# Altium schematic sheet Ethernet.SchDoc: Bluetooth Gateway
size A3; CheckedBy: QUOCTHANG; DrawnBy: DONGKHOA; Revision: V1.0.0; SheetNumber: 7; SheetTotal: 10
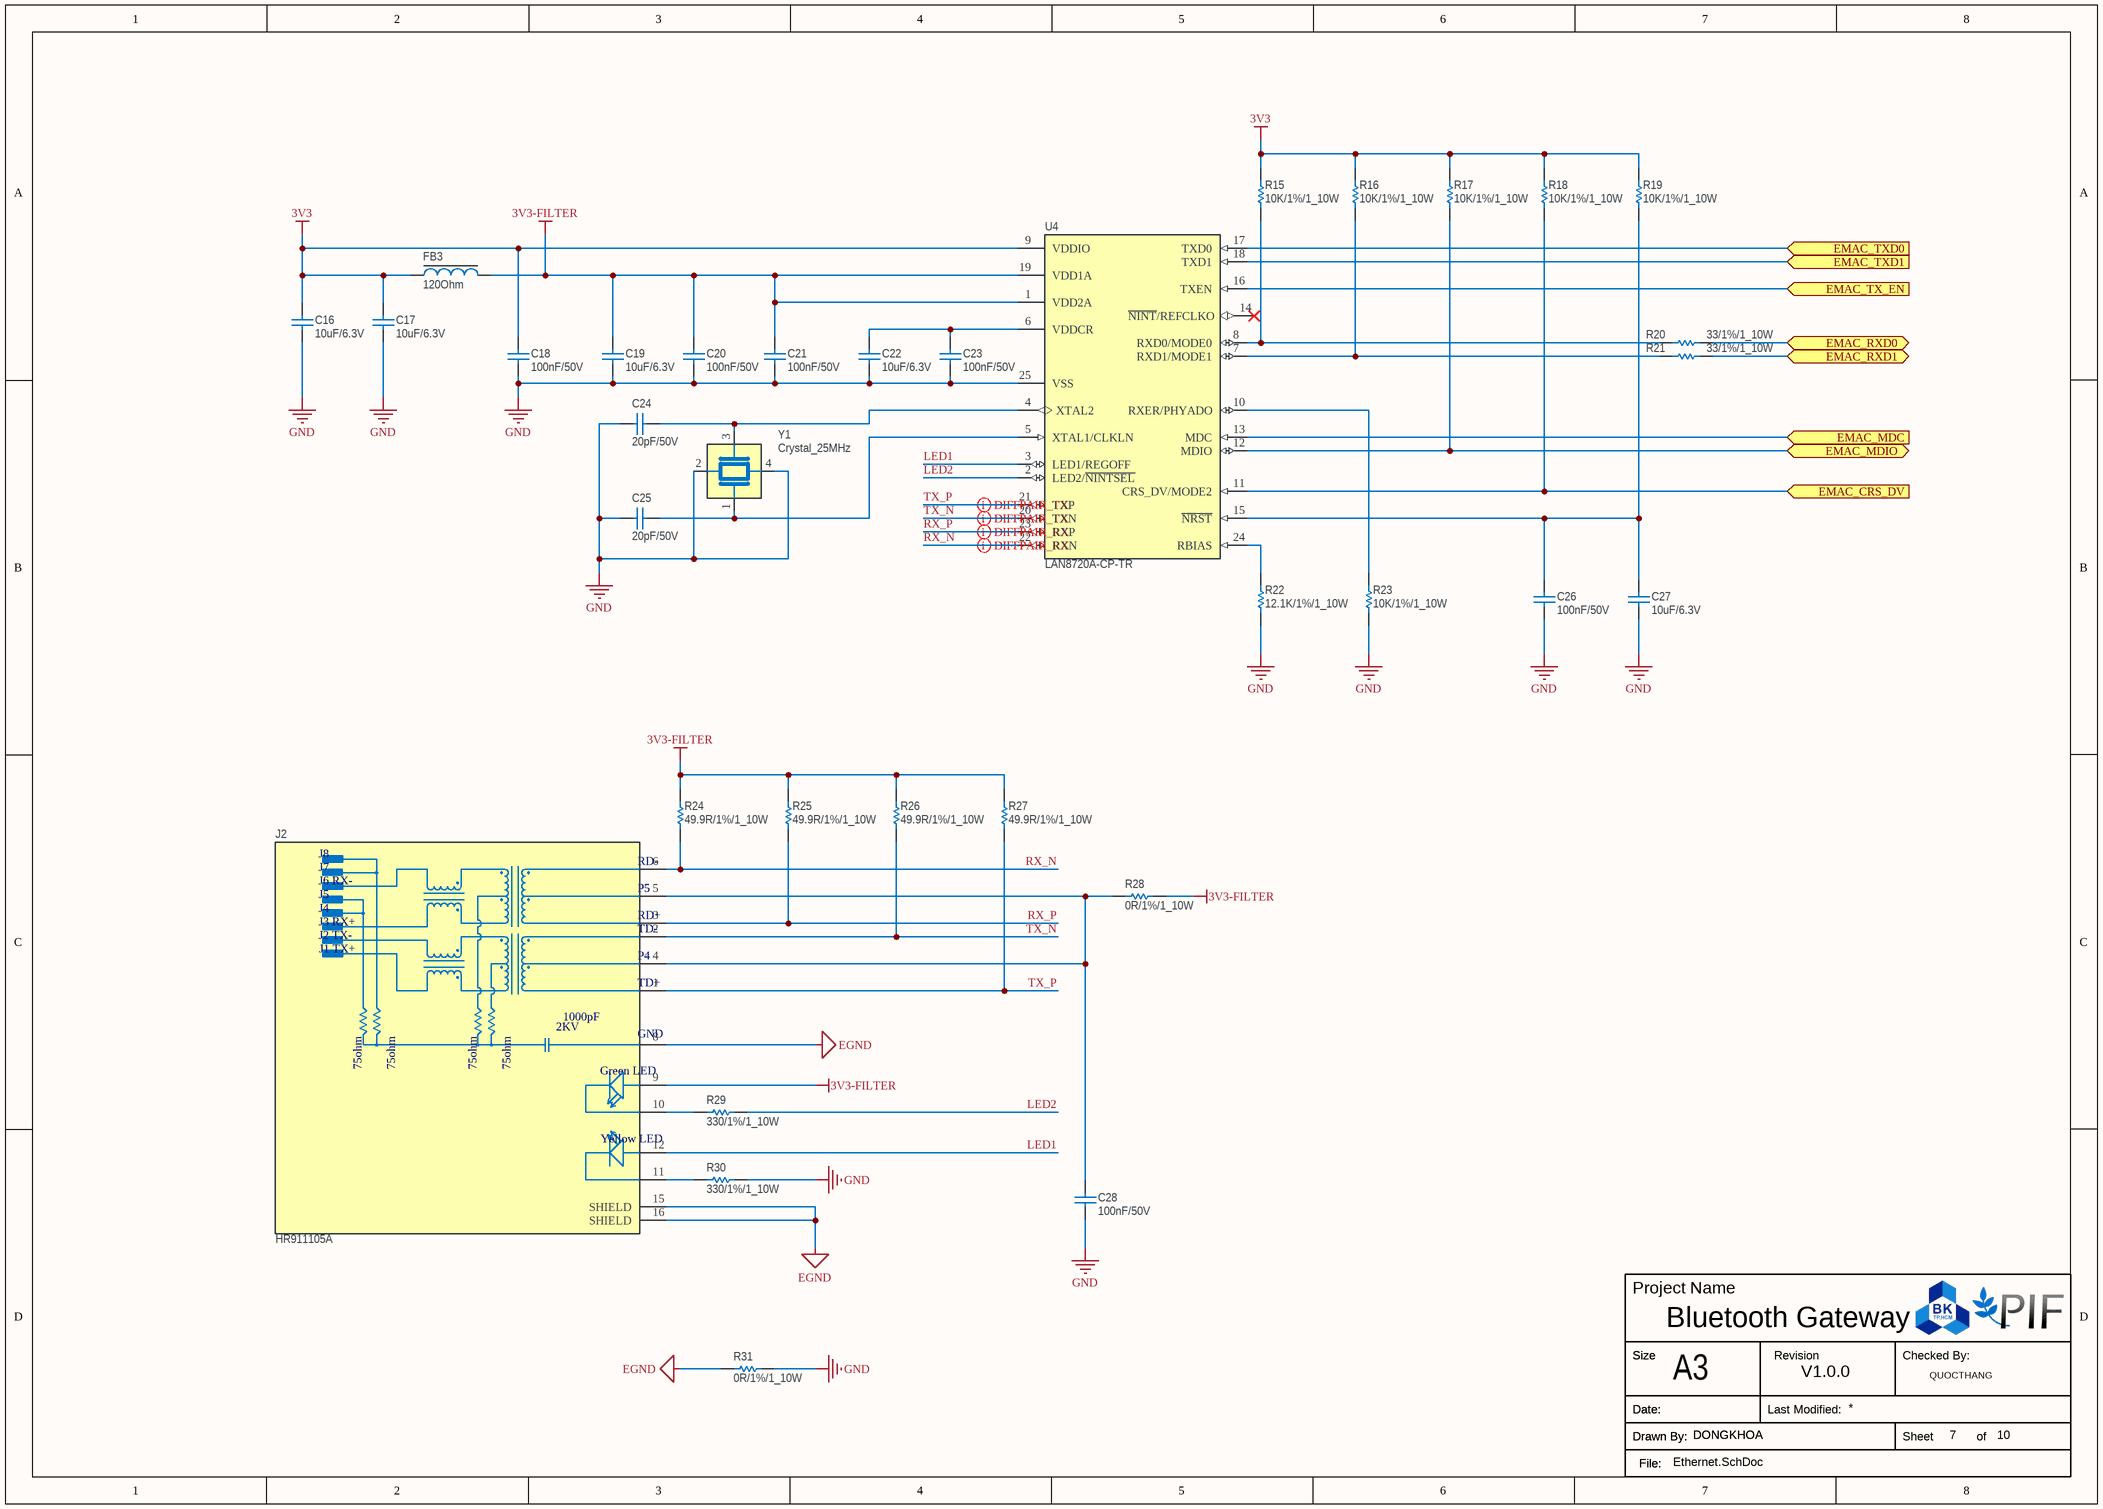
[diagram p0: Ethernet.SchDoc]

## Parts
C16  10uF/6.3V  [CAP_0603]
C17  10uF/6.3V  [CAP_0603]
C18  100nF/50V  [CAP_0603]
C19  10uF/6.3V  [CAP_0603]
C20  100nF/50V  [CAP_0603]
C21  100nF/50V  [CAP_0603]
C22  10uF/6.3V  [CAP_0603]
C23  100nF/50V  [CAP_0603]
C24  20pF/50V  [CAP_0603]
C25  20pF/50V  [CAP_0603]
C26  100nF/50V  [CAP_0603]
C27  10uF/6.3V  [CAP_0603]
C28  100nF/50V  [CAP_0603]
FB3  120Ohm  [Ferrite_Bead_0805]
J2  HR911105A  [HANRUN_HR911105A]
R15  10K/1%/1_10W  [Resistor_0603]
R16  10K/1%/1_10W  [Resistor_0603]
R17  10K/1%/1_10W  [Resistor_0603]
R18  10K/1%/1_10W  [Resistor_0603]
R19  10K/1%/1_10W  [Resistor_0603]
R20  33/1%/1_10W  [Resistor_0603]
R21  33/1%/1_10W  [Resistor_0603]
R22  12.1K/1%/1_10W  [Resistor_0603]
R23  10K/1%/1_10W  [Resistor_0603]
R24  49.9R/1%/1_10W  [Resistor_0603]
R25  49.9R/1%/1_10W  [Resistor_0603]
R26  49.9R/1%/1_10W  [Resistor_0603]
R27  49.9R/1%/1_10W  [Resistor_0603]
R28  0R/1%/1_10W  [Resistor_0603]
R29  330/1%/1_10W  [Resistor_0603]
R30  330/1%/1_10W  [Resistor_0603]
R31  0R/1%/1_10W  [Resistor_0603]
U4  LAN8720A-CP-TR  [QFN-EP-24]
Y1  Crystal_25MHz  [Crystal_SMD_3225_4P]

## Ports
EMAC_CRS_DV (in, see Overview_Schematic[6B], MCU[3B]), EMAC_MDC (in, see Overview_Schematic[6B], MCU[3B]), EMAC_MDIO (bidir, see Overview_Schematic[6B], MCU[3B]), EMAC_RXD0 (bidir, see Overview_Schematic[6B], MCU[3B]), EMAC_RXD1 (bidir, see Overview_Schematic[6B], MCU[2B]), EMAC_TX_EN (in, see Overview_Schematic[6B], MCU[2B]), EMAC_TXD0 (in, see Overview_Schematic[6B], MCU[2B]), EMAC_TXD1 (in, see Overview_Schematic[6B], MCU[2B])

## Nets
3V3: C16.2 C17.2 C18.2 FB3.1 R15.2 R16.2 R17.2 R18.2 R19.2 U4.9(VDDIO)
3V3-FILTER: C19.2 C20.2 C21.2 FB3.2 J2.9(GA) R24.2 R25.2 R26.2 R27.2 R28.2 U4.1(VDD2A) U4.19(VDD1A)
EGND: J2.8(GND) J2.15(SHIELD) J2.16(SHIELD) R31.1
GND: C16.1 C17.1 C18.1 C19.1 C20.1 C21.1 C22.1 C23.1 C24.2 C25.1 C26.1 C27.1 C28.1 R22.1 R23.1 R30.2 R31.2 U4.25(VSS) Y1.2(GND) Y1.4(GND)
EMAC_CRS_DV: R18.1 U4.11(CRS_DV/MODE2) ; port EMAC_CRS_DV
EMAC_MDC: U4.13(MDC) ; port EMAC_MDC
EMAC_MDIO: R17.1 U4.12(MDIO) ; port EMAC_MDIO
EMAC_RXD0: R20.2 ; port EMAC_RXD0
EMAC_RXD1: R21.2 ; port EMAC_RXD1
EMAC_TX_EN: U4.16(TXEN) ; port EMAC_TX_EN
EMAC_TXD0: U4.17(TXD0) ; port EMAC_TXD0
EMAC_TXD1: U4.18(TXD1) ; port EMAC_TXD1
LED1: J2.12(YA) U4.3(LED1/REGOFF)
LED2: R29.2 U4.2(LED2/~{NINTSEL})
RX_N: J2.6(RD-) R24.1 U4.22(RXN)
RX_P: J2.3(RD+) R25.1 U4.23(RXP)
TX_N: J2.2(TD-) R26.1 U4.20(TXN)
TX_P: J2.1(TD+) R27.1 U4.21(TXP)
NetC22_2: C22.2 C23.2 U4.6(VDDCR)
NetC24_1: C24.1 U4.4(XTAL2) Y1.3
NetC25_2: C25.2 U4.5(XTAL1/CLKLN) Y1.1
NetC26_2: C26.2 C27.2 R19.1 U4.15(~{NRST})
NetC28_2: C28.2 J2.4(P4) J2.5(P5) R28.1
NetJ2_10: J2.10(GC) R29.1
NetJ2_11: J2.11(YC) R30.1
NetR15_1: R15.1 R20.1 U4.8(RXD0/MODE0)
NetR16_1: R16.1 R21.1 U4.7(RXD1/MODE1)
NetR22_2: R22.2 U4.24(RBIAS)
NetR23_2: R23.2 U4.10(RXER/PHYADO)

Not connected (* = marked no-connect by the designer): U4 14(~{NINT}/REFCLKO)*

## Layout directives
differential pair: RX_N, RX_P, TX_N, TX_P

## Notes on the sheet
- Project Name
- Size
- A3
- Revision
- Checked By:
- Drawn By:
- Date:
- File:
- Last Modified:
- Sheet
- of
- (in symbol HR911105A) J8; J7; J6 RX-; J5; J4; J3 RX+; J2 TX-; J1 TX+; 1000pF; 75ohm; 2KV; Green LED; Yellow LED

## Library data of the parts
C16 C17 C19 C22 C27 = Ceramic_Cap_10uF_6.3V_0603: CAP, size 0603, 10uF, 6.3V; Supply Part Number: CC0603KRX5R5BB106; Supply Name: tme; Datasheet: *; Supply URL: http://www.tme.vn/Product.aspx?id=1165#page=pro_info
C18 C20 C21 C23 C26 C28 = Ceramic_Cap_100nF_50V_0603: CAP, size 0603, 100nF, 50V; Supply Part Number: Tụ Gốm 0603 100nF (0.1uF) 50V; Supply Name: Thegioiic; Datasheet: *; Supply URL: https://www.thegioiic.com/tu-gom-0603-100nf-0-1uf-50v
C24 C25 = Ceramic_Cap_20pF_50V_0603: CAP, size 0603, 20pF, 50V; Supply Part Number: CC0603JRNPO9BN200; Supply Name: tme; Datasheet: *; Supply URL: http://tme.vn/Product.aspx?id=1305#page=pro_info
FB3 = Ferrite_Bead_120Ohm_2A_0805: Ferrite Bead, size 0805, 120Ohm, 2A; Supply Part Number: CBW201209U121T Ferrite Beads 2A 120 Ohm 0805; Supply Name: Thegioiic; Supply URL: https://www.thegioiic.com/cbw201209u121t-ferrite-beads-2a-120-ohm-0805
J2 = HR911105A: DIP RJ45 Connector;; Supply Part Number: HR911105A Cổng RJ45 Cái Có LED Hanrun; Supply Name: Thegioiic; Datasheet: https://core-electronics.com.au/attachments/localcontent/cc11be56d66bb63d5f1eeb85492439c0_335950a6d06.pdf; Supply URL: https://www.thegioiic.com/hr911105a-cong-rj45-cai-co-led-hanrun
R15-R19 R23 = Res_10K_0603_1%: Resistor 0603 10KOhm 1% 1_10W; Supply Part Number: Điện Trở 10 KOhm 0603 1%; Supply Name: Thegioiic; Supply URL: https://www.thegioiic.com/dien-tro-10-kohm-0603-1-
R20 R21 = Res_33R_0603_1%: Resistor 0603 33Ohm 1% 1_10W; Supply Part Number: Điện Trở 33 Ohm 0603 1%; Supply Name: Thegioiic; Supply URL: https://www.thegioiic.com/dien-tro-33-ohm-0603-1-
R22 = Res_12.1K_0603_1%: Resistor 0603 12.1KOhm 1% 1_10W; Supply Part Number: Điện Trở 12.1 KOhm 0603 1%; Supply Name: Thegioiic; Supply URL: https://www.thegioiic.com/dien-tro-12-1-kohm-0603-1-
R24-R27 = Res_49.9R_0603_1%: Resistor 0603 49.9 Ohm 1% 1_10W; Supply Part Number: Điện Trở 49.9 Ohm 0603 1%; Supply Name: Thegioiic; Supply URL: https://www.thegioiic.com/dien-tro-49-9-ohm-0603-1-
R28 R31 = Res_0R_0603_1%: Resistor 0603 0 Ohm 1% 1_10W; Supply Part Number: Điện Trở 0 Ohm 0603 1%; Supply Name: Thegioiic; Supply URL: https://www.thegioiic.com/dien-tro-0-ohm-0603-1-
R29 R30 = Res_330_0603_1%: Resistor 0603 330KOhm 1% 1_10W; Supply Part Number: Điện Trở 330 Ohm 0603 1%; Supply Name: Thegioiic; Supply URL: https://www.thegioiic.com/dien-tro-330-ohm-0603-1-
U4 = LAN8720A-CP-TR: PHY 1-CH 10Mbps/100Mbps 2.5V/3.3V 24-PinQFN EP Tray; Supply Part Number: LAN8720A IC Truyền Nhận Ethernet 24-QFN; Supply Name: Thegioiic; Datasheet: https://ww1.microchip.com/downloads/en/devicedoc/00002165b.pdf; Supply URL: https://www.thegioiic.com/lan8720a-ic-truyen-nhan-ethernet-24-qfn
Y1 = Crystal_25MHz: 25 MHz Crystal 4-SMD; Supply Part Number: Thạch Anh 25MHz 3225 4 Chân SMD; Supply Name: Thegioiic; Supply URL: https://www.thegioiic.com/thach-anh-25mhz-3225-4-chan-smd